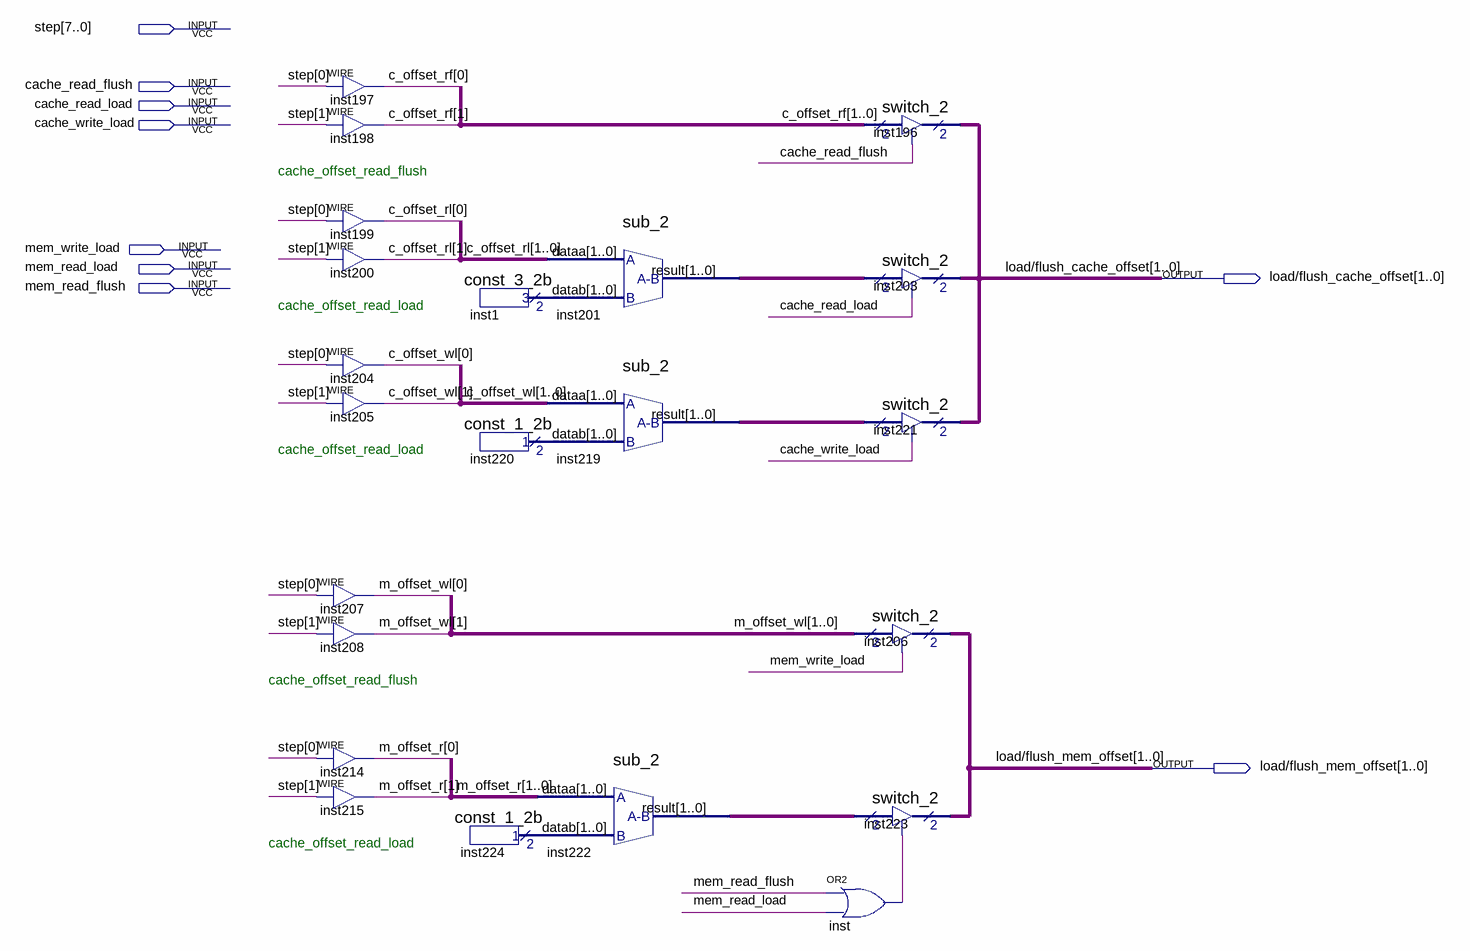
[diagram p0: schematic sheet]
// Quartus schematic load_flush_offset_for_cache.bdf as structural Verilog: 22 symbols, 9 pins
module load_flush_offset_for_cache (
  input  [7:0] step,
  input  cache_read_flush,
  input  cache_read_load,
  input  cache_write_load,
  input  mem_write_load,
  input  mem_read_load,
  input  mem_read_flush,
  output [1:0] \load/flush_cache_offset ,
  output [1:0] \load/flush_mem_offset 
);

  wire inst_out;
  wire [1:0] c_offset_rf, c_offset_rl, c_offset_wl, inst1_result, inst201_result, inst219_result,
       inst220_result, inst222_result, inst224_result, m_offset_r, m_offset_wl;

  assign c_offset_rf[0] = step[0];  // WIRE inst197
  assign c_offset_rf[1] = step[1];  // WIRE inst198
  assign c_offset_rl[0] = step[0];  // WIRE inst199
  assign c_offset_rl[1] = step[1];  // WIRE inst200
  assign c_offset_wl[0] = step[0];  // WIRE inst204
  assign c_offset_wl[1] = step[1];  // WIRE inst205
  assign m_offset_wl[0] = step[0];  // WIRE inst207
  assign m_offset_wl[1] = step[1];  // WIRE inst208
  assign m_offset_r[0] = step[0];  // WIRE inst214
  assign m_offset_r[1] = step[1];  // WIRE inst215
  const_3_2b inst1 (.result(inst1_result));
  const_1_2b inst220 (.result(inst220_result));
  const_1_2b inst224 (.result(inst224_result));
  sub_2 inst201 (.dataa(c_offset_rl), .datab(inst1_result), .result(inst201_result));
  sub_2 inst219 (.dataa(c_offset_wl), .datab(inst220_result), .result(inst219_result));
  sub_2 inst222 (.dataa(m_offset_r), .datab(inst224_result), .result(inst222_result));
  or inst (inst_out, mem_read_flush, mem_read_load);
  switch_2 inst196 (.enabledt(cache_read_flush), .data(c_offset_rf), .tridata(\load/flush_cache_offset ));
  switch_2 inst203 (.enabledt(cache_read_load), .data(inst201_result), .tridata(\load/flush_cache_offset ));
  switch_2 inst221 (.enabledt(cache_write_load), .data(inst219_result), .tridata(\load/flush_cache_offset ));
  switch_2 inst206 (.enabledt(mem_write_load), .data(m_offset_wl), .tridata(\load/flush_mem_offset ));
  switch_2 inst223 (.enabledt(inst_out), .data(inst222_result), .tridata(\load/flush_mem_offset ));

  // Notes on the sheet:
  //   cache_offset_read_flush
  //   cache_offset_read_load
  //   cache_offset_read_load
  //   cache_offset_read_flush
  //   cache_offset_read_load
endmodule
